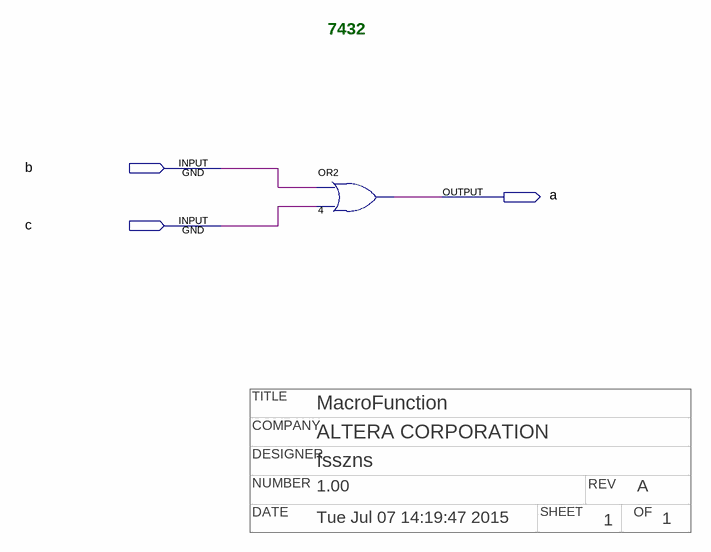
[diagram p0: schematic sheet]
// Quartus schematic a7432.bdf as structural Verilog: 1 symbols, 3 pins
// Title block: TITLE: MacroFunction; COMPANY: ALTERA CORPORATION; DESIGNER: fsszns; NUMBER: 1.00; REV: A; DATE: Tue Jul 07 14:19:47 2015; SHEET: 1; OF: 1
module a7432 (
  input  b,
  input  c,
  output a
);

  or u_4 (a, b, c);

  // Notes on the sheet:
  //   7432
endmodule
